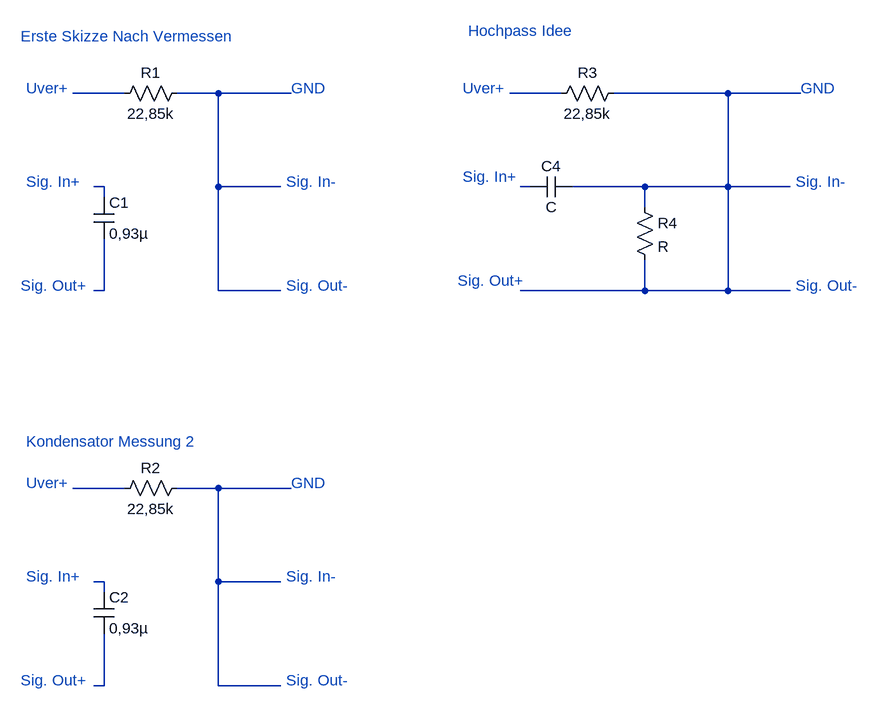
[diagram p0: schematic Erste Skizzen_Überlegungen.asc]
Erste Skizzen_Überlegungen.asc, the LTspice schematic file:
Version 4
SHEET 1 1744 1096
WIRE 256 96 176 96
WIRE 400 96 336 96
WIRE 512 96 400 96
WIRE 928 96 848 96
WIRE 1184 96 1008 96
WIRE 1296 96 1184 96
WIRE 224 240 208 240
WIRE 400 240 400 96
WIRE 496 240 400 240
WIRE 880 240 864 240
WIRE 1056 240 944 240
WIRE 1184 240 1184 96
WIRE 1184 240 1056 240
WIRE 1280 240 1184 240
WIRE 224 256 224 240
WIRE 1056 272 1056 240
WIRE 224 400 224 320
WIRE 224 400 208 400
WIRE 400 400 400 240
WIRE 496 400 400 400
WIRE 1056 400 1056 352
WIRE 1056 400 864 400
WIRE 1184 400 1184 240
WIRE 1184 400 1056 400
WIRE 1280 400 1184 400
WIRE 256 704 176 704
WIRE 400 704 336 704
WIRE 512 704 400 704
WIRE 224 848 208 848
WIRE 400 848 400 704
WIRE 496 848 400 848
WIRE 224 864 224 848
WIRE 224 1008 224 928
WIRE 224 1008 208 1008
WIRE 400 1008 400 848
WIRE 496 1008 400 1008
SYMBOL res 352 80 R90
WINDOW 0 0 56 VBottom 2
WINDOW 3 32 56 VTop 2
SYMATTR InstName R1
SYMATTR Value 22,85k
SYMBOL cap 208 256 R0
SYMATTR InstName C1
SYMATTR Value 0,93µ
SYMBOL res 1024 80 R90
WINDOW 0 0 56 VBottom 2
WINDOW 3 32 56 VTop 2
SYMATTR InstName R3
SYMATTR Value 22,85k
SYMBOL cap 944 224 R90
WINDOW 0 0 32 VBottom 2
WINDOW 3 32 32 VTop 2
SYMATTR InstName C4
SYMBOL res 1040 256 R0
SYMATTR InstName R4
SYMBOL res 352 688 R90
WINDOW 0 0 56 VBottom 2
WINDOW 3 32 56 VTop 2
SYMATTR InstName R2
SYMATTR Value 22,85k
SYMBOL cap 208 864 R0
SYMATTR InstName C2
SYMATTR Value 0,93µ
TEXT 104 88 Left 2 ;Uver+
TEXT 512 88 Left 2 ;GND
TEXT 104 232 Left 2 ;Sig. In+
TEXT 504 232 Left 2 ;Sig. In-
TEXT 96 392 Left 2 ;Sig. Out+
TEXT 504 392 Left 2 ;Sig. Out-
TEXT 776 88 Left 2 ;Uver+
TEXT 1296 88 Left 2 ;GND
TEXT 776 224 Left 2 ;Sig. In+
TEXT 1288 232 Left 2 ;Sig. In-
TEXT 768 384 Left 2 ;Sig. Out+
TEXT 1288 392 Left 2 ;Sig. Out-
TEXT 96 8 Left 2 ;Erste Skizze Nach Vermessen
TEXT 784 0 Left 2 ;Hochpass Idee
TEXT 104 696 Left 2 ;Uver+
TEXT 512 696 Left 2 ;GND
TEXT 104 840 Left 2 ;Sig. In+
TEXT 504 840 Left 2 ;Sig. In-
TEXT 96 1000 Left 2 ;Sig. Out+
TEXT 504 1000 Left 2 ;Sig. Out-
TEXT 104 632 Left 2 ;Kondensator Messung 2

The netlist it stands for:
* Erste Skizzen_Überlegungen.asc
R1 N002 N001 22,85k
C1 N005 N007 0,93µ
R3 N004 N003 22,85k
C4 N004 N006 C
R4 N004 N004 R
R2 N009 N008 22,85k
C2 N010 N011 0,93µ
* Uver+
* GND
* Sig. In+
* Sig. In-
* Sig. Out+
* Sig. Out-
* Uver+
* GND
* Sig. In+
* Sig. In-
* Sig. Out+
* Sig. Out-
* Erste Skizze Nach Vermessen
* Hochpass Idee
* Uver+
* GND
* Sig. In+
* Sig. In-
* Sig. Out+
* Sig. Out-
* Kondensator Messung 2
.backanno
.end